# EAGLE design BaliseEmetteur(1) (EAGLE 6.5.0)
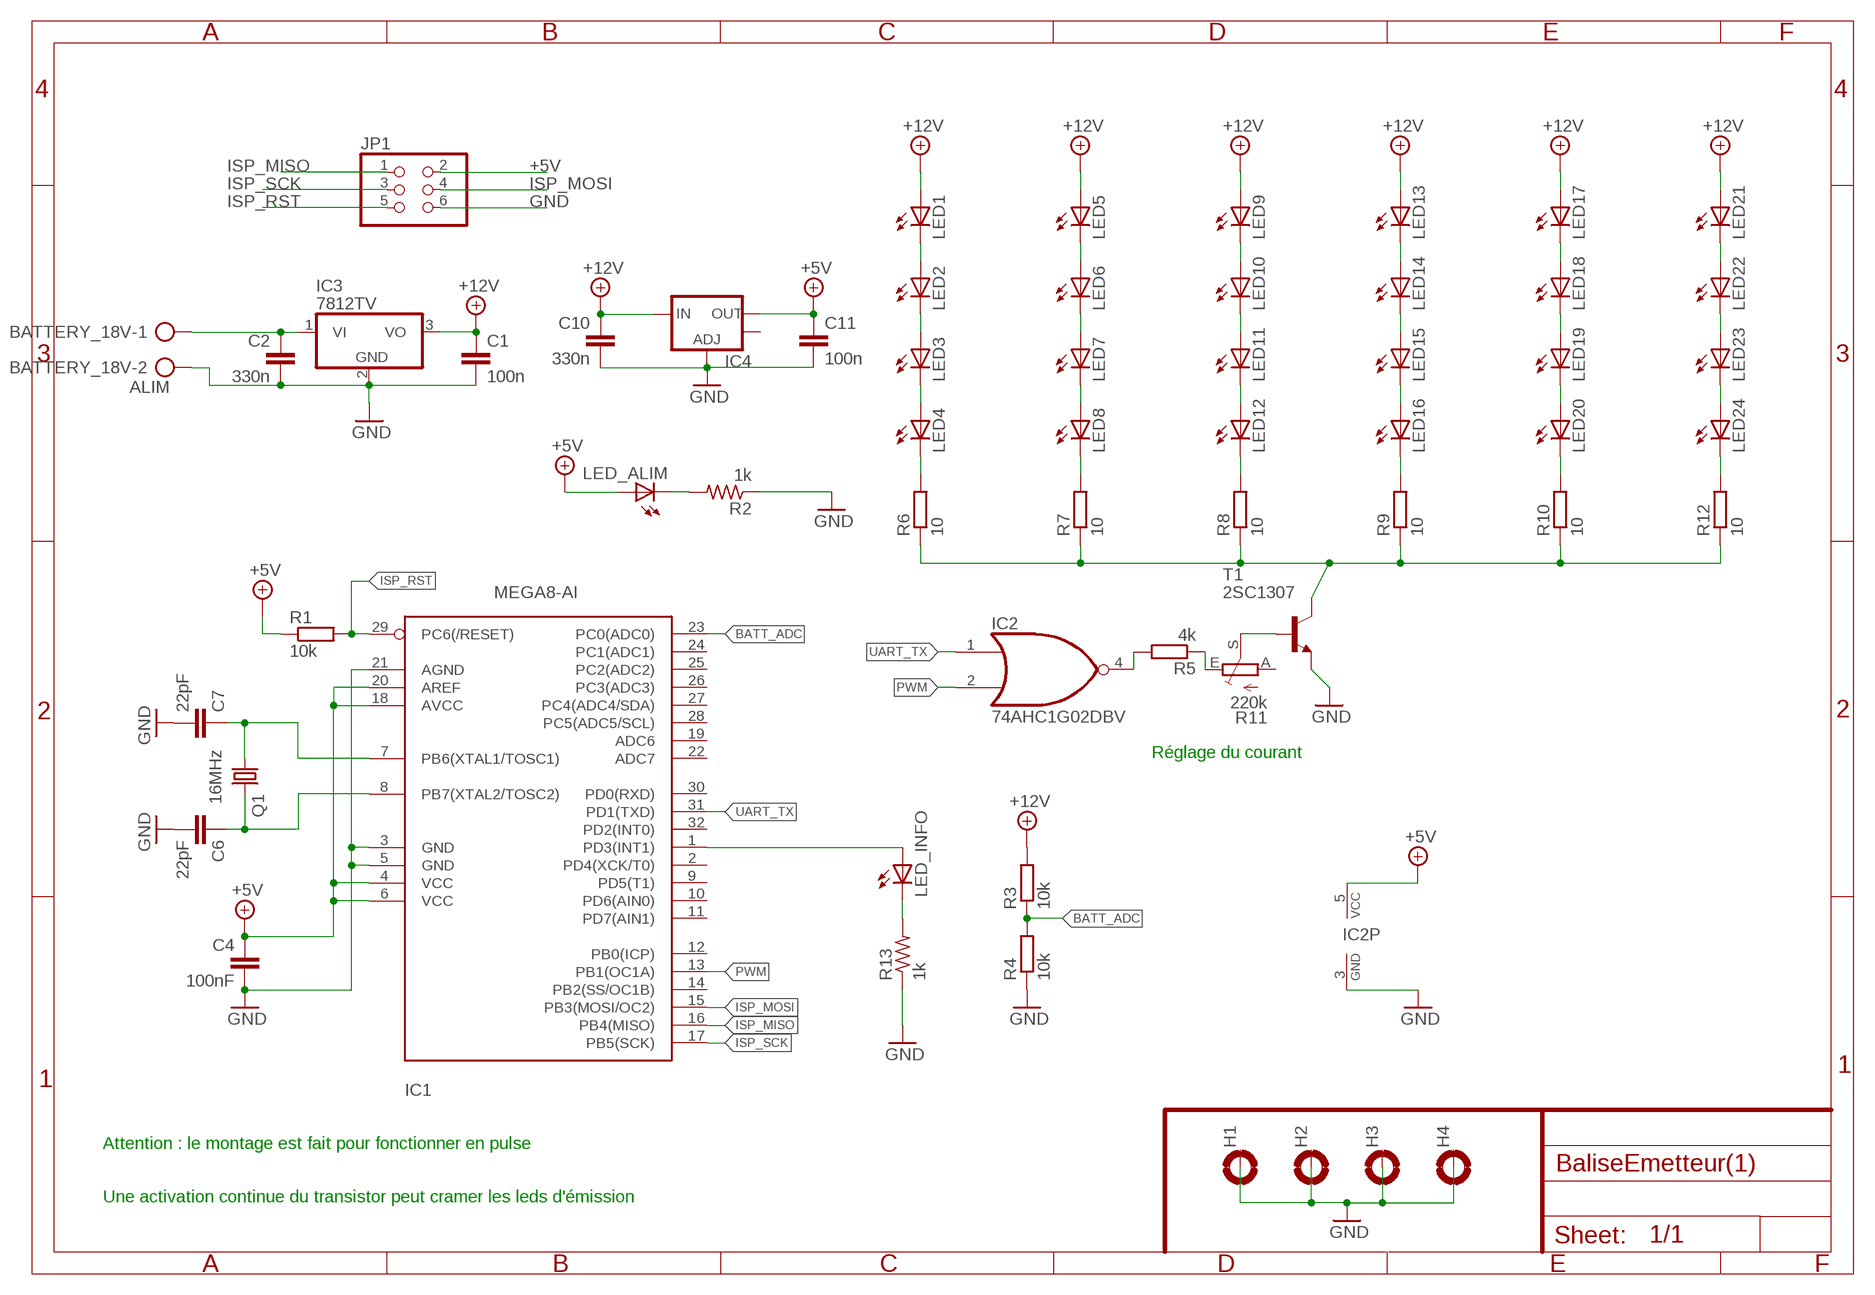
[diagram p0: schematic, sheet 1]

## Parts
BATTERY_18V  ALIM  AK500/2  [AK500/2]
C1  100n  C-EUC0805  [C0805]
C2  330n  C-EUC0805  [C0805]
C4  100nF  C-EUC0805  [C0805]
C6  22pF  C-EUC0805  [C0805]
C7  22pF  C-EUC0805  [C0805]
C10  330n  C-EUC0805  [C0805]
C11  100n  C-EUC0805  [C0805]
H1  MOUNT-PAD-ROUND3.2  [3,2-PAD]
H2  MOUNT-PAD-ROUND3.2  [3,2-PAD]
H3  MOUNT-PAD-ROUND3.2  [3,2-PAD]
H4  MOUNT-PAD-ROUND3.2  [3,2-PAD]
IC1  MEGA8-AI  [TQFP32-08]
IC2  74AHC1G02DBV  [SOT23-5]
IC3  7812TV  [TO220V]
IC4  V_REG_LM1117SOT223  [SOT223]
JP1  PINHD-2X3  [2X03]
LED1  LEDB155  [Q62902-B155]
LED2  LEDB155  [Q62902-B155]
LED3  LEDB155  [Q62902-B155]
LED4  LEDB155  [Q62902-B155]
LED5  LEDB155  [Q62902-B155]
LED6  LEDB155  [Q62902-B155]
LED7  LEDB155  [Q62902-B155]
LED8  LEDB155  [Q62902-B155]
LED9  LEDB155  [Q62902-B155]
LED10  LEDB155  [Q62902-B155]
LED11  LEDB155  [Q62902-B155]
LED12  LEDB155  [Q62902-B155]
LED13  LEDB155  [Q62902-B155]
LED14  LEDB155  [Q62902-B155]
LED15  LEDB155  [Q62902-B155]
LED16  LEDB155  [Q62902-B155]
LED17  LEDB155  [Q62902-B155]
LED18  LEDB155  [Q62902-B155]
LED19  LEDB155  [Q62902-B155]
LED20  LEDB155  [Q62902-B155]
LED21  LEDB155  [Q62902-B155]
LED22  LEDB155  [Q62902-B155]
LED23  LEDB155  [Q62902-B155]
LED24  LEDB155  [Q62902-B155]
LED_ALIM  LEDCHIPLED_0805  [CHIPLED_0805]
LED_INFO  LEDCHIPLED_0805  [CHIPLED_0805]
Q1  16MHz  CRYSTALHC49UP  [HC49UP]
R1  10k  R-EU_0207/2V  [0207/2V]
R2  1k  R-US_R0805W  [R0805W]
R3  10k  R-EU_0207/2V  [0207/2V]
R4  10k  R-EU_0207/2V  [0207/2V]
R5  4k  R-EU_0207/2V  [0207/2V]
R6  10  R-EU_0207/2V  [0207/2V]
R7  10  R-EU_0207/2V  [0207/2V]
R8  10  R-EU_0207/2V  [0207/2V]
R9  10  R-EU_0207/2V  [0207/2V]
R10  10  R-EU_0207/2V  [0207/2V]
R11  220k  TRIM_EU-CA9V  [CA9V]
R12  10  R-EU_0207/2V  [0207/2V]
R13  1k  R-US_R0805W  [R0805W]
T1  2SC1307  [TO220AV]

## Nets
+5V: C4.1 C11.1 IC1.4(VCC) IC1.6(VCC) IC1.18(AVCC) IC1.20(AREF) IC2.5(VCC) IC4.2(OUT) JP1.2 LED_ALIM.A R1.1
+12V: C1.1 C10.1 IC3.3(VO) IC4.3(IN) LED1.A LED5.A LED9.A LED13.A LED17.A LED21.A R3.2
BATT_ADC: IC1.23(PC0(ADC0)) R3.1 R4.2
GND: BATTERY_18V.2 C1.2 C2.2 C4.2 C6.2 C7.2 C10.2 C11.2 H1.B3,2(MOUNT) H2.B3,2(MOUNT) H3.B3,2(MOUNT) H4.B3,2(MOUNT) IC1.3(GND) IC1.5(GND) IC1.21(AGND) IC2.3(GND) IC3.2(GND) IC4.1(ADJ) JP1.6 R2.1 R4.1 R13.1 T1.3(E)
ISP_MISO: IC1.16(PB4(MISO)) JP1.1
ISP_MOSI: IC1.15(PB3(MOSI/OC2)) JP1.4
ISP_RST: IC1.29(PC6(/RESET)) JP1.5 R1.2
ISP_SCK: IC1.17(PB5(SCK)) JP1.3
N$1: LED_INFO.C R13.2
N$2: LED1.K(C) LED2.A
N$3: IC2.4(O) R5.2
N$4: IC1.1(PD3(INT1)) LED_INFO.A
N$5: LED3.K(C) LED4.A
N$6: LED6.K(C) LED7.A
N$7: LED5.K(C) LED6.A
N$8: C7.1 IC1.7(PB6(XTAL1/TOSC1)) Q1.1
N$9: C6.1 IC1.8(PB7(XTAL2/TOSC2)) Q1.2
N$10: LED7.K(C) LED8.A
N$11: LED18.K(C) LED19.A
N$12: LED9.K(C) LED10.A
N$13: LED2.K(C) LED3.A
N$14: LED11.K(C) LED12.A
N$15: R5.1 R11.E
N$16: LED13.K(C) LED14.A
N$17: R6.1 R7.1 R8.1 R9.1 R10.1 R12.1 T1.2(C)
N$18: LED15.K(C) LED16.A
N$19: BATTERY_18V.1 C2.1 IC3.1(VI)
N$20: LED22.K(C) LED23.A
N$21: LED17.K(C) LED18.A
N$22: LED19.K(C) LED20.A
N$23: LED4.K(C) R6.2
N$24: LED21.K(C) LED22.A
N$25: LED10.K(C) LED11.A
N$26: LED23.K(C) LED24.A
N$27: LED8.K(C) R7.2
N$28: LED14.K(C) LED15.A
N$29: LED12.K(C) R8.2
N$30: LED16.K(C) R9.2
N$32: LED20.K(C) R10.2
N$33: LED24.K(C) R12.2
N$34: LED_ALIM.C R2.2
PWM: IC1.13(PB1(OC1A)) IC2.2(I1)
TIP122: R11.S T1.1(B)
UART_TX: IC1.31(PD1(TXD)) IC2.1(I0)
Unconnected: IC1.2(PD4(XCK/T0)) IC1.9(PD5(T1)) IC1.10(PD6(AIN0)) IC1.11(PD7(AIN1)) IC1.12(PB0(ICP)) IC1.14(PB2(SS/OC1B)) IC1.19(ADC6) IC1.22(ADC7) IC1.24(PC1(ADC1)) IC1.25(PC2(ADC2)) IC1.26(PC3(ADC3)) IC1.27(PC4(ADC4/SDA)) IC1.28(PC5(ADC5/SCL)) IC1.30(PD0(RXD)) IC1.32(PD2(INT0)) IC4.4(OUT) R11.A

## Notes on the sheet
- Réglage du courant
- Attention : le montage est fait pour fonctionner en pulse
- Une activation continue du transistor peut cramer les leds d'émission

## Library data of the parts
BATTERY_18V = con-ptr500:AK500/2: CONNECTOR
C1 C2 C4 C6 C7 C10 C11 = rcl:C-EU: CAPACITOR, European symbol
H1-H4 = holes:MOUNT-PAD-ROUND: MOUNTING PAD, round
IC1 = atmel:MEGA8: MICROCONTROLLER 8 Kbytes FLASH, 1 kbytes SRAM, 512 bytes EEPROM, USART, 6-channel 10 bit ADC, 2-channel 8 bit ADC Pin compatible with Atmega48, ATMega88, ATMega168 Source: avr.lbr
IC2 = 74xx-little-us:74*1G02: 2-input NOR gate
IC3 = linear:78*: Positive VOLTAGE REGULATOR Source: http://cache.national.com/ds/LM/LM78L05.pdf http://www.fairchildsemi.com/ds/LM/LM7805.pdf
IC4 = SparkFun-PowerIC:V_REG_LM1117: Voltage Regulator LM1117 Standard adjustable voltage regulator but in SMD form. Spark Fun Electronics SKU : COM-00595
JP1 = pinhead:PINHD-2X3: PIN HEADER
LED1-LED24 = led:LED: LED
LED_ALIM LED_INFO = adafruit:LED: LED
Q1 = crystal:CRYSTAL: CRYSTAL
R1 R3-R10 R12 = rcl:R-EU_: RESISTOR, European symbol
R2 R13 = adafruit:R-US_: RESISTOR, American symbol
R11 = pot:TRIM_EU-: POTENTIOMETER
T1 = transistor:2SC1307: NPN Transistor Silicon Epitaxial, High Frequency Power Amplifier Source: 2SC1307.pdf

## Board
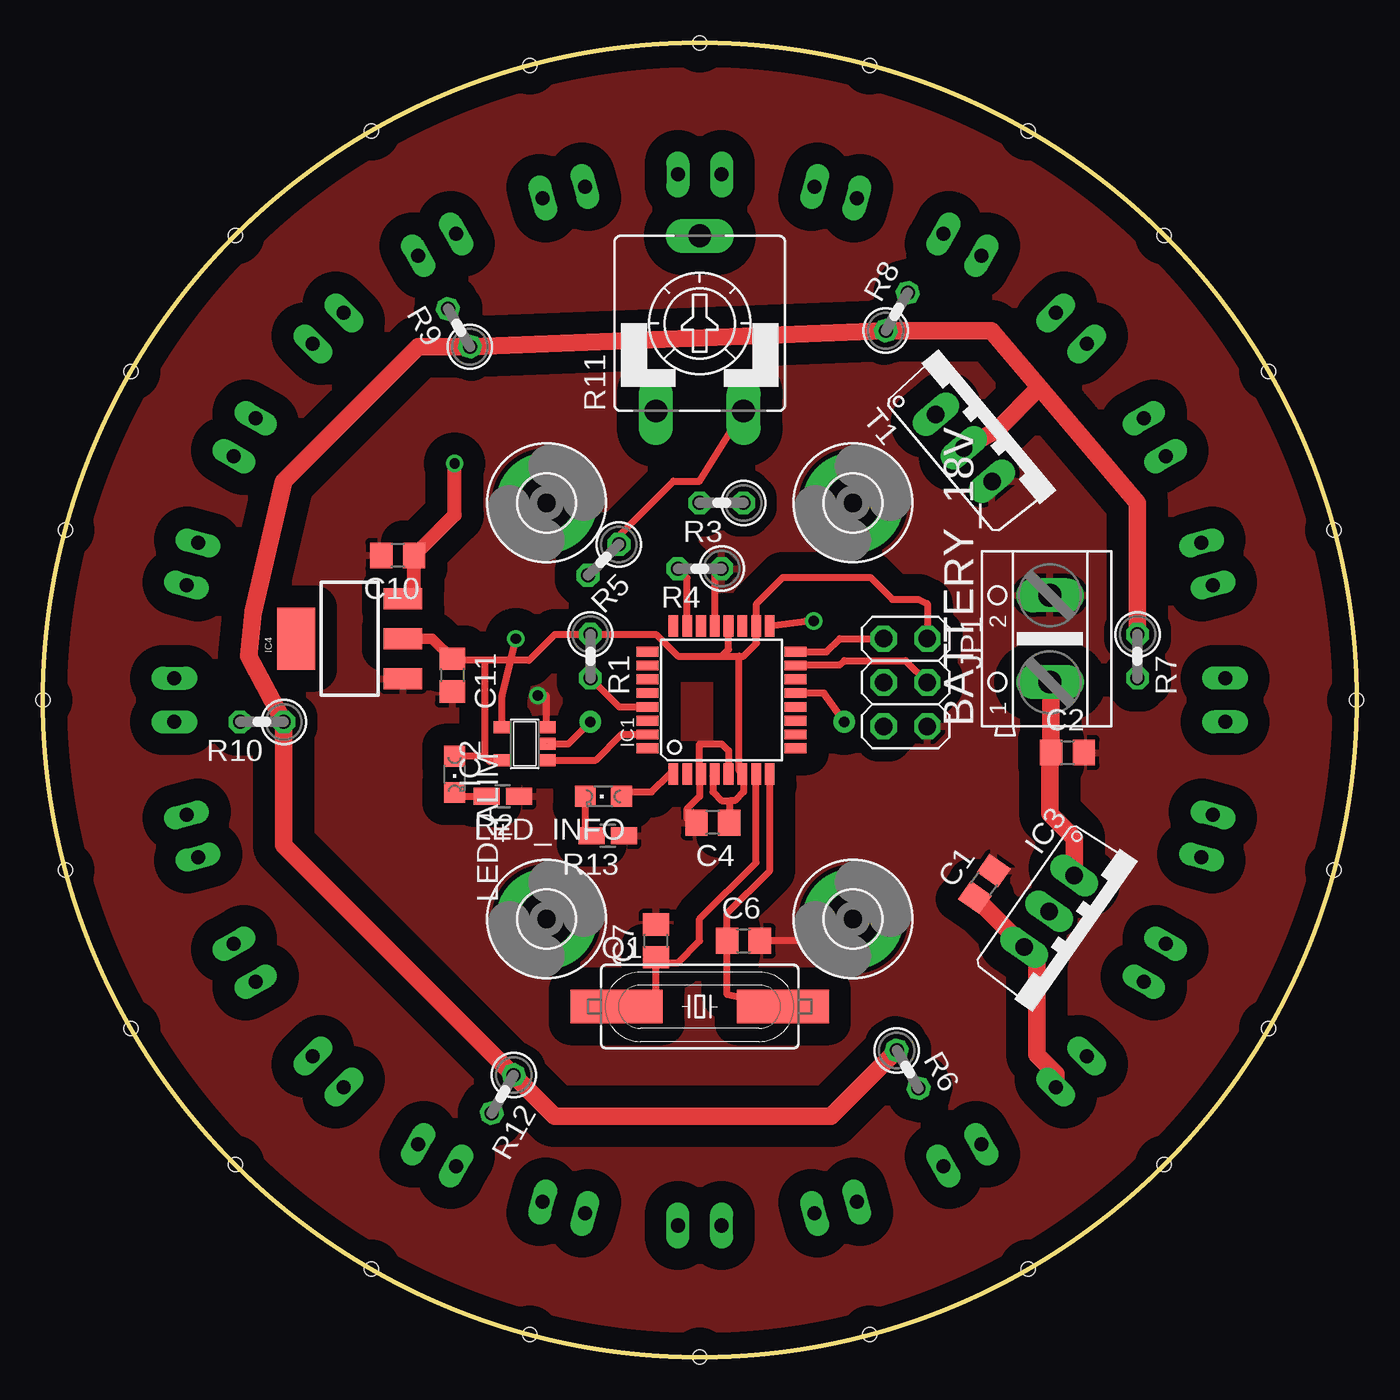
[diagram p1: board, top side]
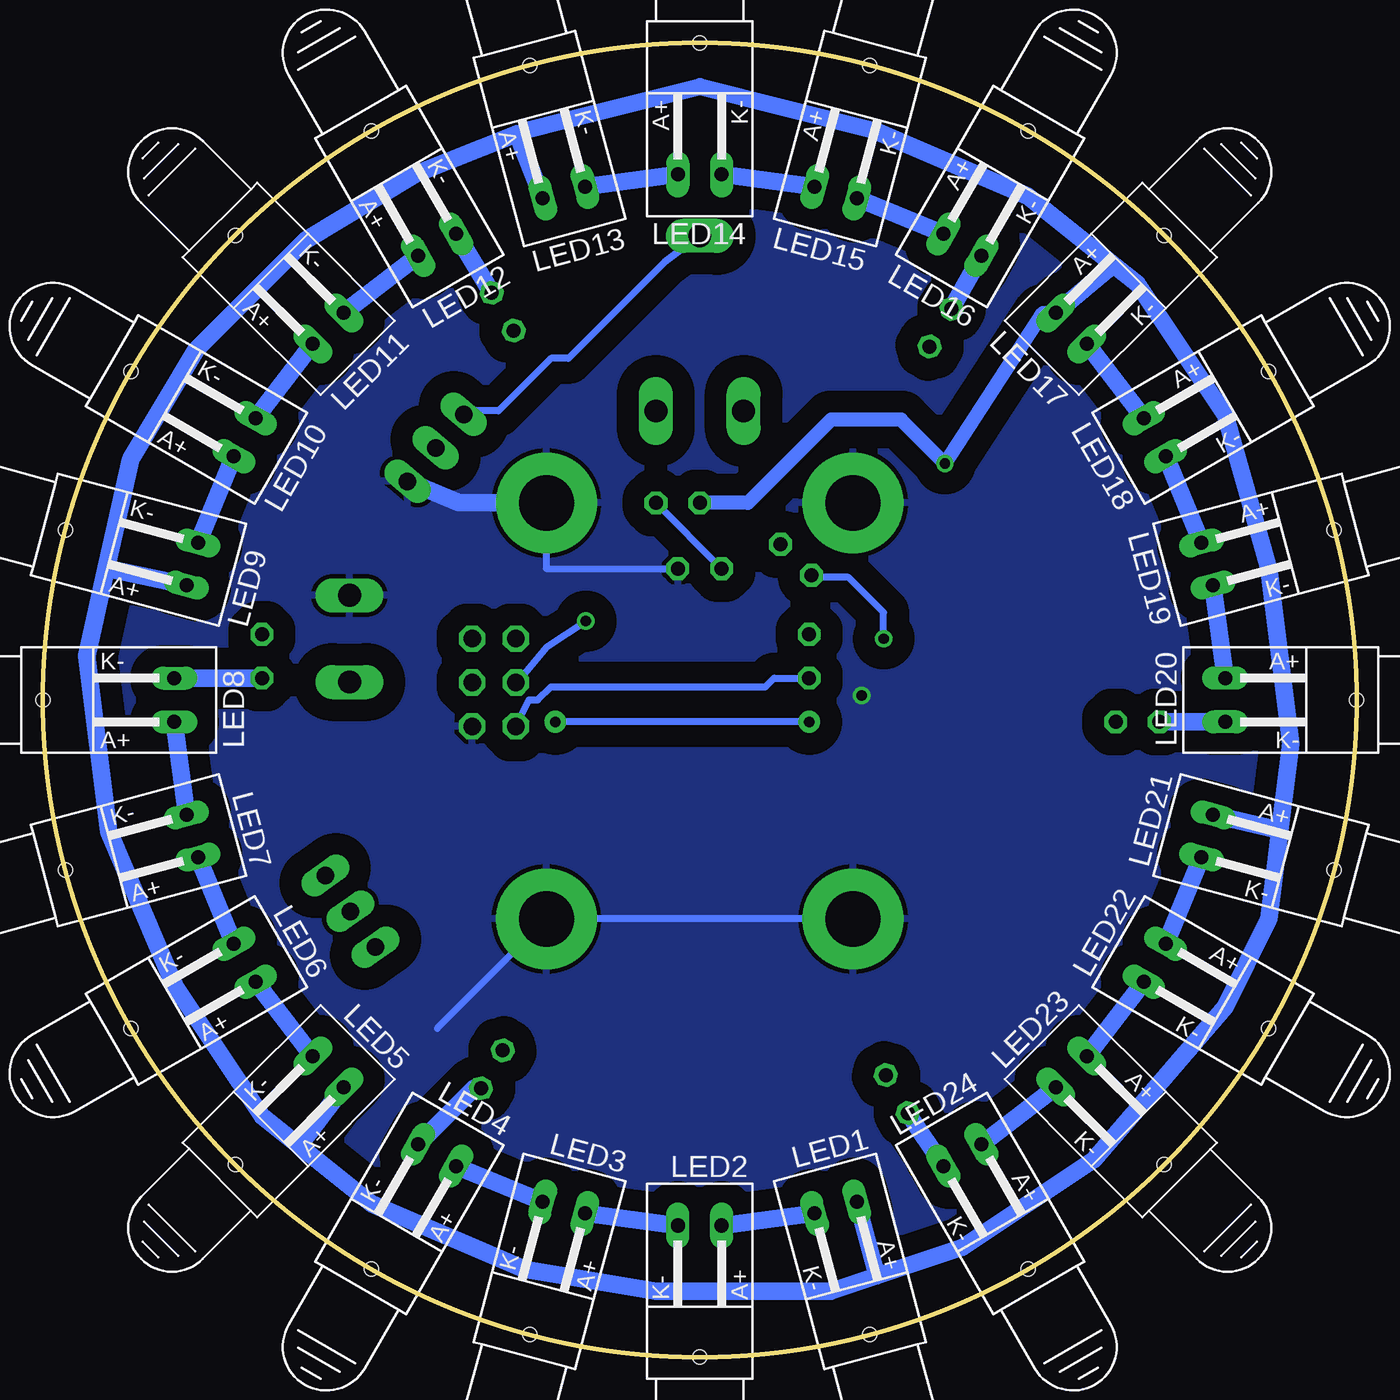
[diagram p2: board, bottom side, seen from below]

Size 76.2 x 76.2 mm. Coordinates in mm from the lower left corner, seen from the top.
Outline: circle at 38.1,38.1 radius 38.1
Copper layers (1*16): Top 0.1mm / dielectric 1.5mm / Bottom 0.1mm
Design rules "ensea": minimum track width 0.5mm, minimum drill 0.5mm, track to track 0.5mm, track to pad 0.5mm, pad to pad 0.5mm, via to via 0.5mm, smd to smd 8mil, copper to edge 40mil, drill to drill 8mil, minimum pad ring 10mil, minimum via ring 8mil, stop-mask expansion 4mil, vias tented up to drill 0mil, thermal gap 10mil

### Footprints (pad centres in the part's own frame; a part is rotated, then mirrored left to right if it is on the bottom)
AK500/2 = drill 1.321 long: 1 -2.515,0; 2 2.515,0
C0805 = smd 1.3 x 1.5: 1 -0.95,0; 2 0.95,0
3,2-PAD = drill 3.2 pad 5.842: B3,2 0,0
TQFP32-08 = smd 1.27 x 0.559: 1 -4.293,2.8; 2 -4.293,2; 3 -4.293,1.2; 4 -4.293,0.4; 5 -4.293,-0.4; 6 -4.293,-1.2; 7 -4.293,-2; 8 -4.293,-2.8; 17 4.293,-2.8; 18 4.293,-2; 19 4.293,-1.2; 20 4.293,-0.4; 21 4.293,0.4; 22 4.293,1.2; 23 4.293,2; 24 4.293,2.8 | smd 0.559 x 1.27: 9 -2.8,-4.293; 10 -2,-4.293; 11 -1.2,-4.293; 12 -0.4,-4.293; 13 0.4,-4.293; 14 1.2,-4.293; 15 2,-4.293; 16 2.8,-4.293; 25 2.8,4.293; 26 2,4.293; 27 1.2,4.293; 28 0.4,4.293; 29 -0.4,4.293; 30 -1.2,4.293; 31 -2,4.293; 32 -2.8,4.293
SOT23-5 = smd 0.69 x 0.99: 1 -0.95,-1.29; 2 0,-1.29; 3 0.95,-1.29; 4 0.95,1.3; 5 -0.95,1.3
TO220V = drill 1.016 long: 1 -2.54,-2.54; 2 0,-2.54; 3 2.54,-2.54
SOT223 = smd 1.219 x 2.235: 1 -2.311,-3.099; 2 0,-3.099; 3 2.311,-3.099 | smd 3.6 x 2.2: 4 0,3.099
2X03 = drill 1.016 octagon: 1 -2.54,-1.27; 2 -2.54,1.27; 3 0,-1.27; 4 0,1.27; 5 2.54,-1.27; 6 2.54,1.27
Q62902-B155 = drill 0.813 long: A 7.62,-1.27; K 7.62,1.27 | hole 0.813: 0,0
CHIPLED_0805 = smd 1.2 x 1.2: A 0,-1.05; C 0,1.05
HC49UP = smd 5.334 x 1.93: 1 -4.826,0; 2 4.826,0
0207/2V = drill 0.813 octagon: 1 -1.27,0; 2 1.27,0
R0805W = smd 1.5 x 1: 1 -0.94,0; 2 0.94,0
CA9V = drill 1.321 long: A -2.54,-5.08; E 2.54,-5.08; S 0,5.08
TO220AV = drill 1.016 long: 1 -2.54,-2.54; 2 0,-2.54; 3 2.54,-2.54

### Placement (x,y rotation side)
BATTERY_18V  58.42,41.66 90 top
C1  54.61,27.43 55 top
C2  59.44,35.05 0 top
C4  38.86,30.99 180 top
C6  40.64,24.13 0 top
C7  35.56,24.13 90 top
C10  20.57,46.48 180 top
C11  23.75,39.54 270 top
H1  46.99,49.53 0 top
H2  29.21,49.53 0 top
H3  46.99,25.4 0 top
H4  29.21,25.4 0 top
IC1  39.37,38.1 90 top
IC2  27.94,35.56 90 top
IC3  60.45,24.38 235 top
IC4  17.78,41.66 90 top
JP1  50.04,39.12 270 top
LED1  28.24,1.3 105 bottom
LED2  38.1,0 90 bottom
LED3  47.96,1.3 75 bottom
LED4  57.15,5.1 60 bottom
LED5  65.04,11.16 45 bottom
LED6  71.1,19.05 30 bottom
LED7  74.9,28.24 15 bottom
LED8  76.2,38.1 0 bottom
LED9  74.9,47.96 345 bottom
LED10  71.1,57.15 330 bottom
LED11  65.04,65.04 315 bottom
LED12  57.15,71.1 300 bottom
LED13  47.96,74.9 285 bottom
LED14  38.1,76.2 270 bottom
LED15  28.24,74.9 255 bottom
LED16  19.05,71.1 240 bottom
LED17  11.16,65.04 225 bottom
LED18  5.1,57.15 210 bottom
LED19  1.3,47.96 195 bottom
LED20  0,38.1 180 bottom
LED21  1.3,28.24 165 bottom
LED22  5.1,19.05 150 bottom
LED23  11.16,11.16 135 bottom
LED24  19.05,5.1 120 bottom
LED_ALIM  23.88,33.78 180 top
LED_INFO  32.51,32.51 90 top
Q1  38.1,20.32 0 top
R1  31.75,40.64 270 top
R2  26.67,32.51 180 top
R3  39.37,49.53 180 top
R4  38.1,45.72 180 top
R5  32.51,46.23 225 top
R6  50.16,16.68 300 top
R7  63.5,40.64 270 top
R8  49.53,60.62 60 top
R9  24.13,59.69 120 top
R10  12.7,36.83 180 top
R11  38.1,59.94 0 top
R12  26.67,15.24 240 top
R13  32.77,30.23 180 top
T1  55.37,54.36 310 top

### Tracks (layer width: path | path; a pad name or v marks a point on that pad's centre or on a via)
+5V
  Top 0.406: 39.37,40.64 36.83,40.64 35.56,41.91 R1.1 29.7,41.91 28.18,40.4 25.65,40.4 | 39.37,40.64 39.77,41.04 IC1.20 | IC1.18 41.37,41.37 41.15,41.15 | 39.37,40.64 40.39,40.64 | 40.39,40.64 40.64,40.64 41.15,41.15 | 25.65,40.4 23.84,40.4 C11.1 | 41.15,41.15 | 41.15,41.15 41.4,41.4 41.4,43.69 42.93,45.21 48.01,45.21 49.28,43.94 50.8,43.94 51.31,43.69 JP1.2 | 40.39,40.64 40.39,33.99 IC1.6 40.64,33.74 40.64,32.77 40.13,32.26 39.88,32.26 | IC2.5 26.57,34.54 25.91,34.54 25.65,34.8 | 25.65,34.8 25.65,40.4 | IC1.4 38.86,33.7 38.86,32.77 39.37,32.26 39.88,32.26 | 39.88,32.26 39.81,32.19 C4.1 | 25.65,34.8 25.62,34.83 LED_ALIM.A
  Top 0.61: IC4.2 22.58,41.66 C11.1
+12V  (via drill 0.6)
  Top 0.813: IC4.3 21.52,44.61 C10.1 23.88,48.83 v23.88,51.82
  Top 1.016: C1.1 56.91,23.8 IC3.3 57.66,23.02 57.66,17.53 58.76,16.43 LED5.A
  Bottom 0.406: 48.26,71.12 48.7,70.94
  Bottom 0.813: LED17.A 18.19,60.55 v23.88,51.82 26.42,54.36 30.48,54.36 35.31,49.53 R3.2
  Bottom 1.016: 4.43,30.56 4.77,27.9 5.08,25.4 7.62,20.32 15.24,11.43 22.86,6.35 27.81,4.7 | 4.43,30.56 3.81,35.56 5.08,45.72 7.62,54.61 12.7,62.23 14.09,63.34 | 14.09,63.34 19.05,67.31 27.94,71.12 38.1,73.66 45.87,71.72 48.26,71.12 | 72.52,45.75 73.66,40.64 72.39,30.48 68.58,21.59 63.5,13.97 61.33,12.24 | 72.52,45.75 71.99,48.17 71.12,52.07 67.31,58.42 60.96,64.77 54.61,68.58 48.7,70.94 LED13.A | 61.33,12.24 57.15,8.89 48.26,5.08 40.64,3.81 30.48,3.81 27.81,4.7 | 4.43,30.56 LED21.A | 14.09,63.34 LED17.A | 72.52,45.75 LED9.A | 61.33,12.24 LED5.A | 27.81,4.7 LED1.A
BATT_ADC
  Top 0.406: R4.2 37.37,45.18 IC1.23
  Bottom 0.406: R4.2 R3.1
GND  (via drill 0.6)
  Top 0.406: IC1.5 39.77,35.16 39.37,35.56 38.1,35.56 38.1,33.88 IC1.3 38.1,33.74 38.1,32.51 37.34,31.75 37.34,31.24 37.59,30.99 C4.2 | IC1.21 38.97,45.32 R4.1 | 29.21,36.51 IC2.3 29.21,36.53 29.21,38.35 v28.7,38.35 | C6.2 45.72,24.13 H3.B3,2 | H1.B3,2 48.57,47.95
  Bottom 0.406: H1.B3,2 46.99,45.72 R4.1 | H4.B3,2 H3.B3,2 53.34,19.05
  Bottom 1.016: T1.3 52.07,49.53 H1.B3,2
  pour Top (isolate 1.27): 86.36,85.09 -8.89,85.09 -8.89,-12.7 86.36,-12.7
  pour Bottom (isolate 1.27): -8.89,85.09 86.36,85.09 86.36,-12.7 -8.89,-12.7
ISP_MISO
  Top 0.406: IC1.16 45.47,40.89 46.23,41.66 JP1.1
ISP_MOSI
  Top 0.406: IC1.15 43.69,40.13 46.23,40.13 46.48,40.39 50.04,40.39 JP1.4
ISP_RST
  Top 0.406: R1.2 33.42,37.7 IC1.29
  Bottom 0.406: JP1.5 48.01,38.1 47.5,38.1 46.74,38.86 34.29,38.86 33.78,39.37 R1.2
ISP_SCK  (via drill 0.6)
  Top 0.406: IC1.17 44.23,42.67 v44.7,42.67
  Bottom 0.406: v44.7,42.67 46.99,41.15 48.26,39.62 JP1.3
N$1
  Top 0.406: R13.2 31.46,30.59 LED_INFO.C
N$2
  Bottom 1.016: LED1.K LED2.A
N$3  (via drill 0.6)
  Top 0.406: IC2.4 26.64,38.32 v27.43,41.66
  Bottom 0.406: v27.43,41.66 27.43,43.18 29.46,45.21 31.5,45.21 R5.2
N$4
  Top 0.406: LED_INFO.A 33.82,32.77 35.31,32.77 36.35,33.81 IC1.1
N$5
  Bottom 1.016: LED3.K LED4.A
N$6
  Bottom 1.016: LED6.K LED7.A
N$7
  Bottom 1.016: LED5.K LED6.A
N$8
  Top 0.406: Q1.1 35.56,20.07 C7.1 35.88,22.86 36.83,22.86 38.1,24.13 38.1,25.4 41.37,28.67 IC1.7
N$9
  Top 0.406: Q1.2 39.69,21.02 C6.1 39.69,25.72 42.17,28.2 IC1.8
N$10
  Bottom 1.016: LED7.K LED8.A
N$11
  Bottom 1.016: LED19.A LED18.K
N$12
  Bottom 1.016: LED9.K LED10.A
N$13
  Bottom 1.016: LED2.K LED3.A
N$14
  Bottom 1.016: LED12.A LED11.K
N$15
  Top 0.406: R5.1 33.41,47.63 36.58,50.8 38.1,50.8 R11.E
N$16
  Bottom 1.016: LED14.A LED13.K
N$17
  Top 1.016: R6.1 45.72,13.97 29.67,13.97 R12.1 13.97,29.68 R10.1 11.94,40.64 12.19,43.18 13.97,50.8 21.76,58.59 R9.1 R8.1 55.03,59.52 57.82,56.23 | 57.82,56.23 63.5,49.53 R7.1 | T1.2 55.33,53.74 57.82,56.23
N$18
  Bottom 1.016: LED16.A LED15.K
N$19
  Top 1.016: BATTERY_18V.1 58.49,39.08 C2.1 58.42,34.99 58.42,31.5 59.83,30.09 IC3.1
N$20
  Bottom 1.016: LED23.A LED22.K
N$21
  Bottom 1.016: LED18.A LED17.K
N$22
  Bottom 1.016: LED20.A LED19.K
N$23
  Bottom 0.406: R6.2 51.2,15.58
  Bottom 1.016: 51.2,15.58 LED4.K
N$24
  Bottom 1.016: LED22.A LED21.K
N$25
  Bottom 1.016: LED10.K LED11.A
N$26
  Bottom 1.016: LED24.A LED23.K
N$27
  Bottom 1.016: R7.2 LED8.K
N$28
  Bottom 1.016: LED15.A LED14.K
N$29
  Bottom 1.016: R8.2 LED12.K
N$30
  Bottom 1.016: R9.2 LED16.K
N$32
  Bottom 1.016: LED20.K R10.2
N$33
  Bottom 1.016: LED24.K R12.2
N$34
  Top 0.406: LED_ALIM.C 23.62,32.48 23.88,32.51 R2.2
PWM  (via drill 0.61 pad 1.27)
  Top 0.406: IC2.2 30.48,35.56 v31.75,36.83 | v46.48,36.83 45.32,38.5 IC1.13
  Bottom 0.406: v31.75,36.83 v46.48,36.83
TIP122
  Bottom 0.406: R11.S 40.13,63.5 45.72,57.91 46.74,57.91 49.78,54.86 51.73,54.86 T1.1
UART_TX
  Top 0.406: IC2.1 32.07,34.61 33.56,36.1 IC1.31